# EAGLE design my_dac_amp_pwr_v0002 (EAGLE 6.4)
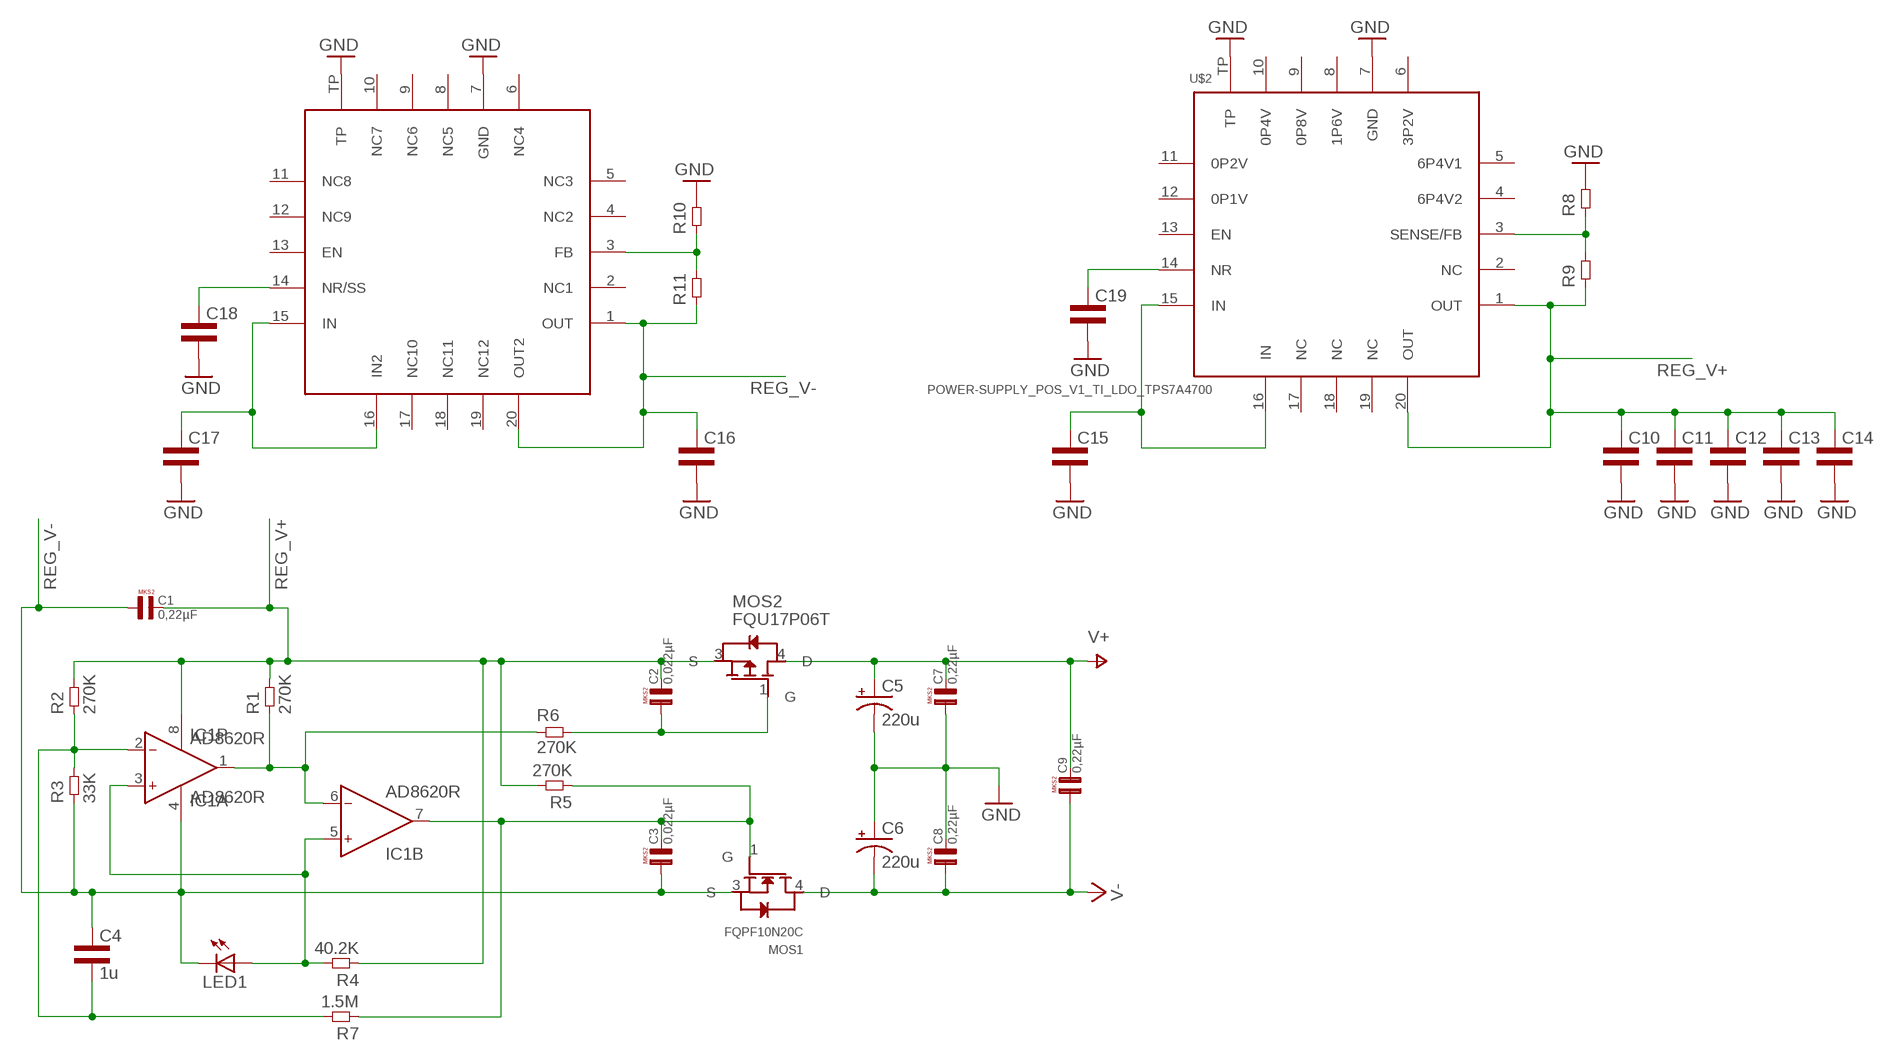
[diagram p0: schematic, sheet 1]

## Parts
C1  0,22µF  [R5B3]
C2  0,022µF  [R5B2K5]
C3  0,022µF  [R5B2K5]
C4  1u  CAP0805L3  [0805L3]
C5  220u  CPOL-USE5-10.5  [E5-10,5]
C6  220u  CPOL-USE5-10.5  [E5-10,5]
C7  0,22µF  [R5B3]
C8  0,22µF  [R5B3]
C9  0,22µF  [R5B3]
C10  CAP0805L3  [0805L3]
C11  CAP0805L3  [0805L3]
C12  CAP0805L3  [0805L3]
C13  CAP0805L3  [0805L3]
C14  CAP0805L3  [0805L3]
C15  CAP0805L3  [0805L3]
C16  CAP0805L3  [0805L3]
C17  CAP0805L3  [0805L3]
C18  CAP0603L3  [0603L3]
C19  CAP0603L3  [0603L3]
IC1  AD8620R  [SO8]
LED1  LED3MM  [LED3MM]
MOS1  FQPF10N20C  MOSFET-N  [DPAK-3]
MOS2  FQU17P06T  MOSFET-P  [DPAK-3]
R1  270K  RES0805L3  [0805L3]
R2  270K  RES0805L3  [0805L3]
R3  33K  RES0805L3  [0805L3]
R4  40.2K  RES0805L3  [0805L3]
R5  270K  RES0805L3  [0805L3]
R6  270K  RES0805L3  [0805L3]
R7  1.5M  RES0805L3  [0805L3]
R8  RES0603L3  [0603L3]
R9  RES0603L3  [0603L3]
R10  RES0603L3  [0603L3]
R11  RES0603L3  [0603L3]
U$1  POWER-SUPPLY_POS_V1_TI_LDO_TPS7A3301RGWT  [POWER-SUPPLY_POS_V1_TI_LDO_VQFN-20]
U$2  POWER-SUPPLY_POS_V1_TI_LDO_TPS7A4700  [POWER-SUPPLY_POS_V1_TI_LDO_VQFN-20]

## Nets
GND: C5.- C6.+ C7.1 C8.2 C10.2 C11.2 C12.2 C13.2 C14.2 C15.2 C16.2 C17.2 C18.P$2 C19.P$2 R8.P$2 R10.P$2 U$1.7(GND) U$1.TP U$2.7(GND) U$2.TP
N$1: IC1.3(A:IN+) IC1.5(B:IN+) LED1.A R4.2
N$2: C4.2 IC1.2(A:IN-) R2.1 R3.2 R7.2
N$4: IC1.1(A:OUT) IC1.6(B:IN-) R1.1 R6.1
N$5: C17.1 U$1.15(IN) U$1.16(IN2)
N$6: C2.1 MOS2.1(G) R6.2
N$7: C15.1 U$2.15(IN) U$2.16(IN)
N$10: C3.2 IC1.7(B:OUT) MOS1.1(G) R5.1 R7.1
N$11: R10.P$1 R11.P$2 U$1.3(FB)
N$12: R8.P$1 R9.P$2 U$2.3(SENSE/FB)
N$14: C18.P$1 U$1.14(NR/SS)
N$15: C19.P$1 U$2.14(NR)
REG_V+: C1.2 C2.2 C10.1 C11.1 C12.1 C13.1 C14.1 IC1.8(P:V+) MOS2.3(S) R1.2 R2.2 R4.1 R5.2 R9.P$1 U$2.1(OUT) U$2.20(OUT)
REG_V-: C1.1 C3.1 C4.1 C16.1 IC1.4(P:V-) LED1.K(C) MOS1.3(S) R3.1 R11.P$1 U$1.1(OUT) U$1.20(OUT2)
V+: C5.+ C7.2 C9.2 MOS2.4(D)
V-: C6.- C8.1 C9.1 MOS1.4(D)
Unconnected: U$1.2(NC1) U$1.4(NC2) U$1.5(NC3) U$1.6(NC4) U$1.8(NC5) U$1.9(NC6) U$1.10(NC7) U$1.11(NC8) U$1.12(NC9) U$1.13(EN) U$1.17(NC10) U$1.18(NC11) U$1.19(NC12) U$2.2(NC) U$2.4(6P4V2) U$2.5(6P4V1) U$2.6(3P2V) U$2.8(1P6V) U$2.9(0P8V) U$2.10(0P4V) U$2.11(0P2V) U$2.12(0P1V) U$2.13(EN) U$2.17(NC) U$2.18(NC) U$2.19(NC)

## Library data of the parts
C1 C7-C9 = Capacitor-Wima-MKS2-63v:0,22µF
C2 C3 = Capacitor-Wima-MKS2-63v:0,022µF
C4 C10-C19 = common:CAP
C5 C6 = rcl:CPOL-US: POLARIZED CAPACITOR, American symbol
IC1 = analog-devices:AD8620: Precision, Very Low Noise, Low Input Bias Current, Wide Bandwidth JFET Operational Amplifiers Source: http://www.analog.com/static/imported-files/data_sheets/AD8610_8620.pdf; MF: ALTERA CORPORATION; MPN: AD8620ARZ; OC_FARNELL: 9994386; OC_NEWARK: 59K6972
LED1 = SparkFun-LED:LED: LEDs Standard schematic elements and footprints for 5mm, 3mm, 1206, and 0603 sized LEDs. 5mm - Spark Fun Electronics SKU : COM-00529 (and others)
MOS1 = common:MOSFET-N
MOS2 = common:MOSFET-P
R1-R11 = common:RES
U$1 = my_dac_amp:POWER-SUPPLY_POS_V1_TI_LDO_TPS7A3301RGWT: Ultra-Low Noise NEGATIVE Voltage Reglator
U$2 = my_dac_amp:POWER-SUPPLY_POS_V1_TI_LDO_TPS7A4700

## Board
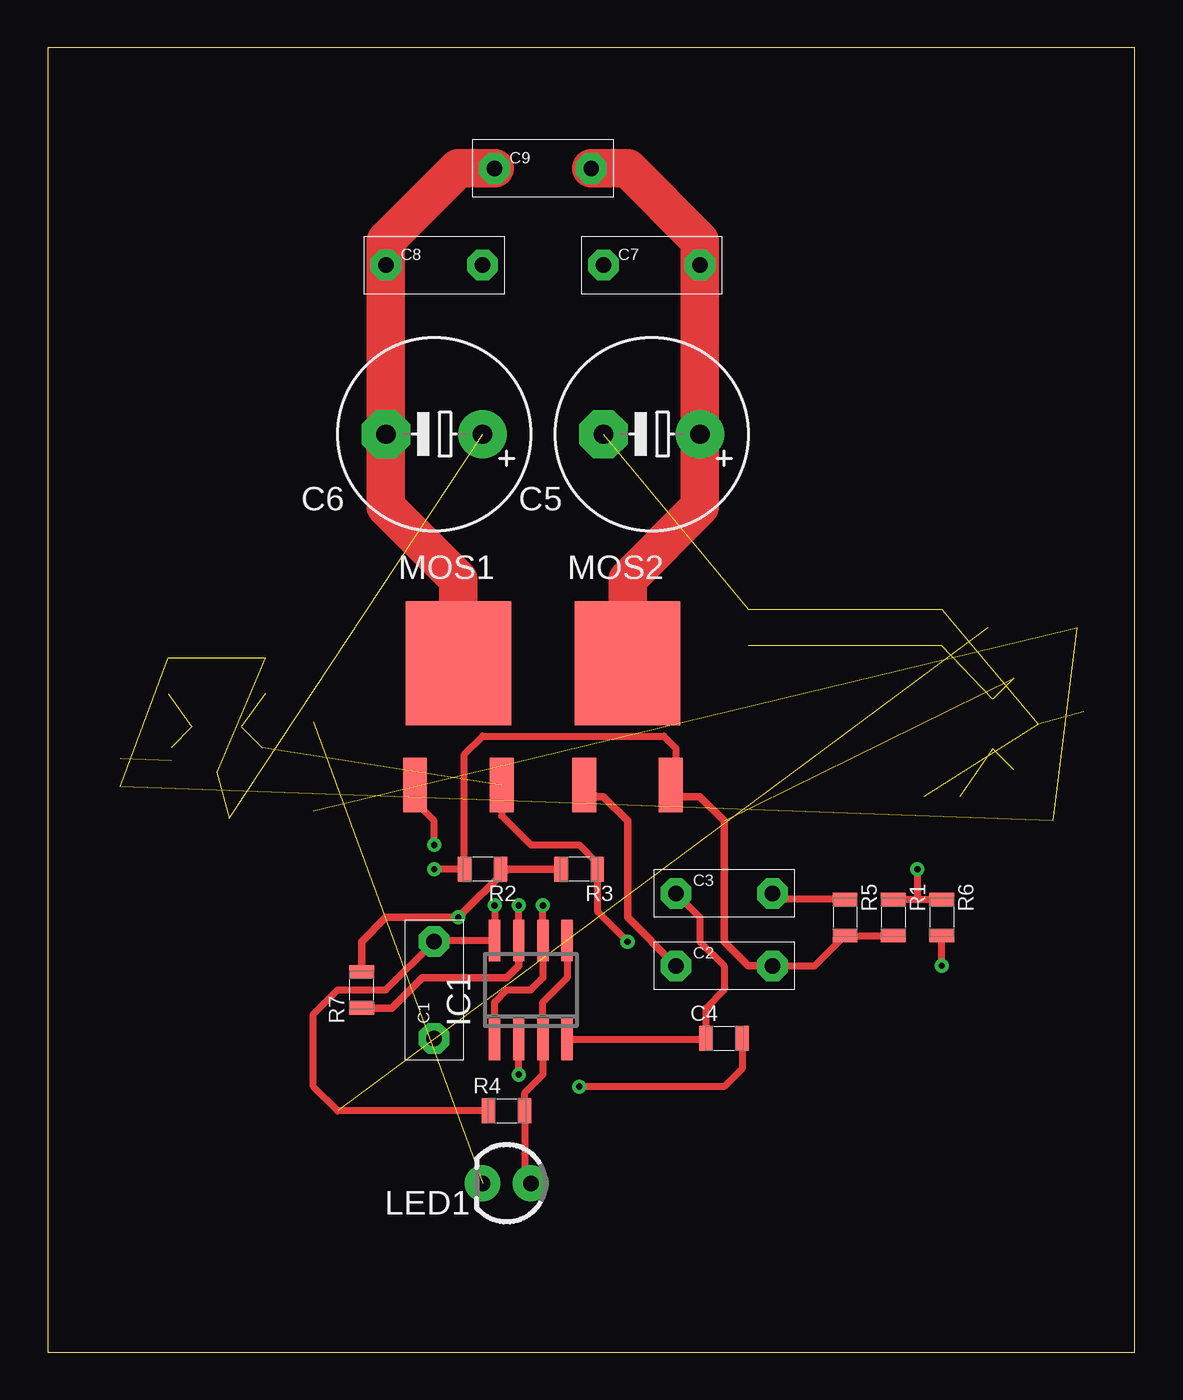
[diagram p1: board, top side]
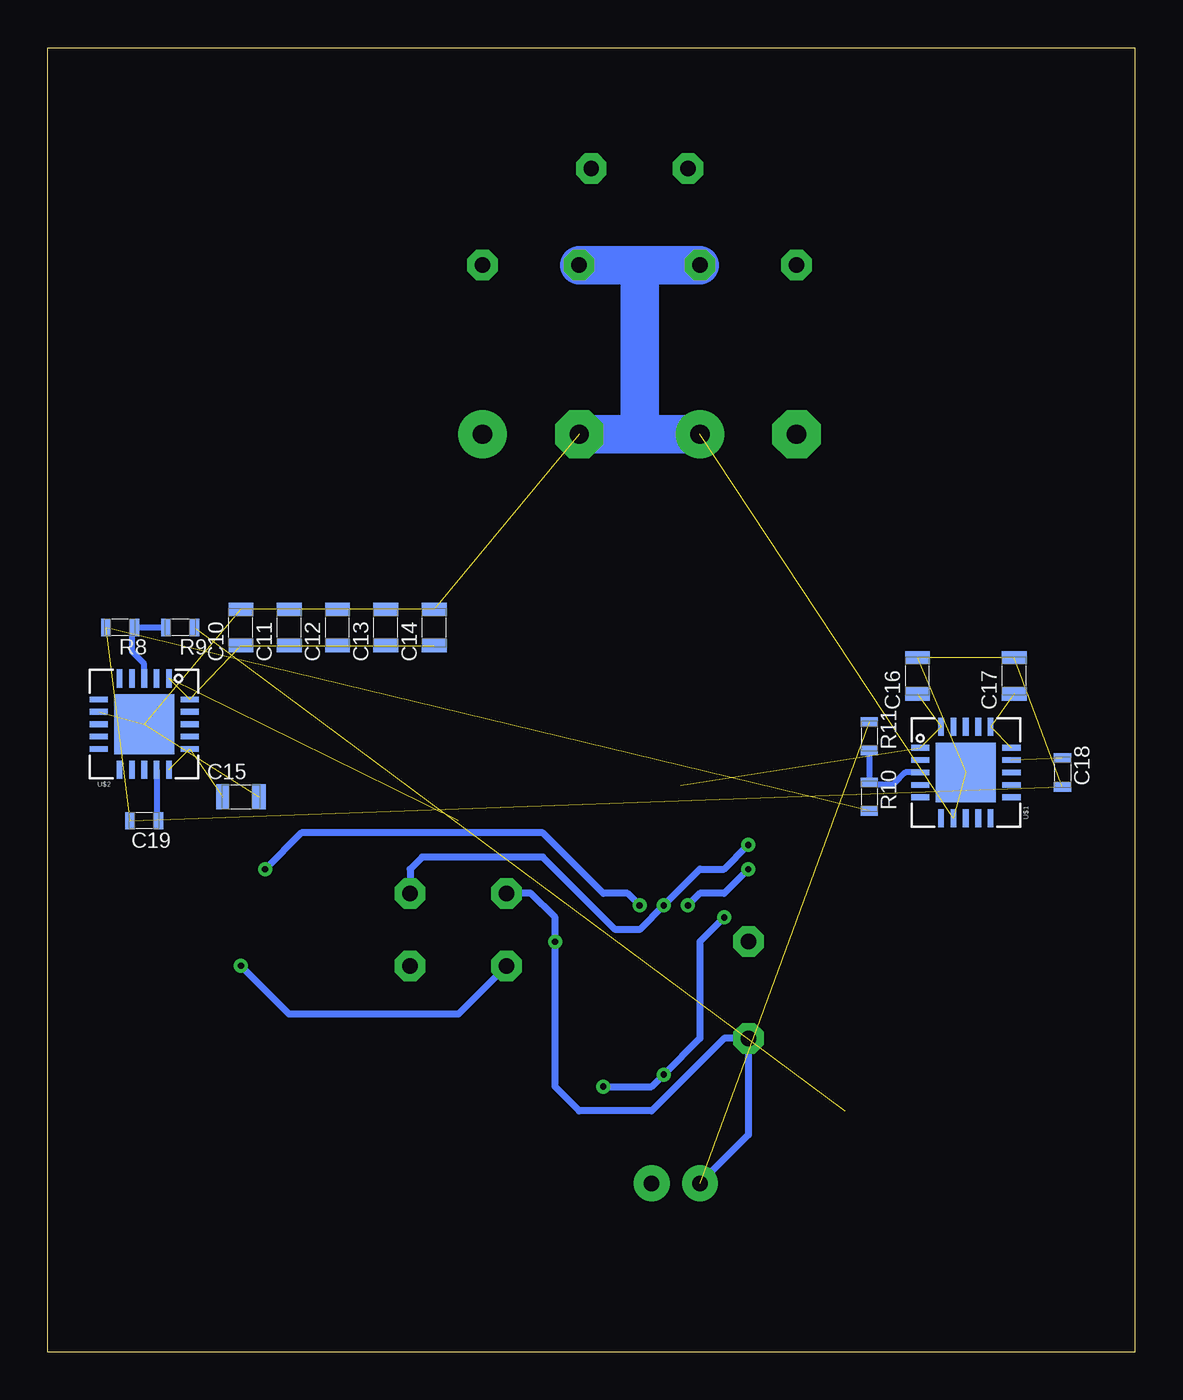
[diagram p2: board, bottom side, seen from below]

Size 57.15 x 68.58 mm. Coordinates in mm from the lower left corner, seen from the top.
Outline: 0,0 57.13,0 57.15,68.58 0,68.58 0,0
Copper layers (1*16): Top 0.035mm / dielectric 1.5mm / Bottom 0.035mm
Design rules "default": minimum track width 10mil, minimum drill 24mil, track to track 8mil, track to pad 8mil, pad to pad 8mil, via to via 8mil, smd to smd 8mil, copper to edge 40mil, drill to drill 8mil, minimum pad ring 10mil, minimum via ring 8mil, stop-mask expansion 4mil, vias tented up to drill 0mil, thermal gap 10mil

### Footprints (pad centres in the part's own frame; a part is rotated, then mirrored left to right if it is on the bottom)
R5B3 = drill 0.813 pad 1.6 octagon: 1 -2.54,0; 2 2.54,0
R5B2K5 = drill 0.813 pad 1.6 octagon: 1 -2.54,0; 2 2.54,0
0805L3 = smd 0.7 x 1.3: 1 -0.95,0; 2 0.95,0
E5-10,5 = drill 1.016 pad 2.54: + -2.54,0 | drill 1.016 pad 2.54 octagon: - 2.54,0
0603L3 = smd 0.5 x 0.9: P$1 -0.75,0; P$2 0.75,0
SO8 = smd 0.6 x 2.2: 1 -1.905,-2.6; 2 -0.635,-2.6; 3 0.635,-2.6; 4 1.905,-2.6; 5 1.905,2.6; 6 0.635,2.6; 7 -0.635,2.6; 8 -1.905,2.6
LED3MM = drill 0.813 pad 1.88: A -1.27,0; K 1.27,0
DPAK-3 = smd 1.25 x 2.85: 1 -2.28,-3.2; 3 2.28,-3.2 | smd 5.55 x 6.5: 4 0,3.2
POWER-SUPPLY_POS_V1_TI_LDO_VQFN-20 = smd 0.3 x 0.95: 1 -1.3,-2.4; 2 -0.65,-2.4; 3 0,-2.4; 4 0.65,-2.4; 5 1.3,-2.4; 11 1.3,2.4; 12 0.65,2.4; 13 0,2.4; 14 -0.65,2.4; 15 -1.3,2.4 | smd 0.95 x 0.3: 6 2.4,-1.3; 7 2.4,-0.65; 8 2.4,0; 9 2.4,0.65; 10 2.4,1.3; 16 -2.4,1.3; 17 -2.4,0.65; 18 -2.4,0; 19 -2.4,-0.65; 20 -2.4,-1.3 | smd 3.15 x 3.15: TP 0,0

### Placement (x,y rotation side)
C1  20.32,19.05 90 top
C2  35.56,20.32 0 top
C3  35.56,24.13 0 top
C4  35.56,16.51 0 top
C5  31.75,48.26 180 top
C6  20.32,48.26 180 top
C7  31.75,57.15 0 top
C8  20.32,57.15 0 top
C9  26.04,62.23 0 top
C10  46.99,38.1 90 bottom
C11  44.45,38.1 90 bottom
C12  41.91,38.1 90 bottom
C13  39.37,38.1 90 bottom
C14  36.83,38.1 90 bottom
C15  46.99,29.21 0 bottom
C16  11.43,35.56 90 bottom
C17  6.35,35.56 90 bottom
C18  3.81,30.48 270 bottom
C19  52.07,27.94 180 bottom
IC1  25.4,19.05 0 top
LED1  24.13,8.89 180 top
MOS1  21.59,33.02 0 top
MOS2  30.48,33.02 0 top
R1  44.45,22.86 270 top
R2  22.86,25.4 180 top
R3  27.94,25.4 180 top
R4  24.13,12.7 0 top
R5  41.91,22.86 270 top
R6  46.99,22.86 270 top
R7  16.51,19.05 90 top
R8  53.34,38.1 180 bottom
R9  50.16,38.1 180 bottom
R10  13.97,29.21 270 bottom
R11  13.97,32.39 270 bottom
U$1  8.89,30.48 270 bottom
U$2  52.07,33.02 180 bottom

### Tracks (layer width: path | path; a pad name or v marks a point on that pad's centre or on a via)
GND  (16 unrouted)
  Bottom 2.032: C6.+ 26.04,48.26 | 26.04,48.26 C5.- | 26.04,57.15 C8.2 | C7.1 26.04,57.15 | 26.04,57.15 26.04,48.26
N$1
  Top 0.356: IC1.5 27.3,19.69 26.04,18.41 IC1.3 26.04,14.6 25.08,13.65 R4.2 25.08,9.21 LED1.A
N$2  (via drill 0.33)
  Top 0.356: C4.2 36.51,14.92 35.56,13.97 v27.94,13.97 | v24.76,14.6 IC1.2
  Top 0.406: R3.2 24.13,25.4 | 24.13,25.4 R2.1 | R7.2 16.51,21.59 17.78,22.86 v21.59,22.86 24.13,25.4
  Bottom 0.356: v27.94,13.97 25.4,13.97 v24.76,14.6 22.86,16.51 22.86,21.59 v21.59,22.86
N$4  (via drill 0.33)
  Top 0.356: R1.1 45.72,23.81 | 45.72,23.81 R6.1 | IC1.1 23.49,18.41 24.13,19.05 25.4,19.05 26.04,19.69 IC1.6 v26.04,23.49 | v45.72,25.4 45.72,23.81
  Bottom 0.356: v26.04,23.49 26.67,24.13 27.94,24.13 31.12,27.3 43.82,27.3 v45.72,25.4
N$5  (2 unrouted)
N$6  (via drill 0.33)
  Top 0.356: v46.99,20.32 R6.2
  Top 0.406: C2.1 30.48,22.86 30.48,27.94 29.21,29.21 28.81,29.21 MOS2.1
  Bottom 0.356: C2.1 35.56,17.78 44.45,17.78 v46.99,20.32
N$7  (2 unrouted)
N$10  (via drill 0.33)
  Top 0.356: IC1.7 v24.76,23.49 | v20.32,26.67 20.32,27.94 19.05,29.21 19.05,29.56 MOS1.1 | R5.1 38.42,23.81 C3.2
  Top 0.406: R7.1 18.1,18.1 19.68,19.69 24.13,19.69 24.76,20.32 IC1.7
  Bottom 0.356: v20.32,26.67 21.59,25.4 22.86,25.4 v24.76,23.49 26.04,22.23 27.3,22.23 31.12,26.03 37.46,26.03 38.1,25.4 C3.2
N$11
  Bottom 0.305: U$1.3 12.07,30.48 12.7,29.84 13.85,29.84 R10.P$1 R11.P$2
N$12
  Bottom 0.305: U$2.3 52.07,36.19 52.71,36.83 52.71,38.1 R8.P$1 R9.P$2
N$14  (1 unrouted)
N$15
  Bottom 0.305: U$2.14 51.42,28.04 C19.P$1
REG_V+  (via drill 0.33)  (8 unrouted)
  Top 0.356: R4.1 15.24,12.7 13.97,13.97 13.97,17.78 15.24,19.05 17.78,19.05 C1.2 20.38,21.65 IC1.8 v23.49,23.49 | v20.32,25.4 R2.2 21.91,31.44 22.86,32.39 32.38,32.39 33.02,31.75 33.02,30.48 32.38,29.84 32.74,29.84 MOS2.3 | C2.2 40.32,20.32 R5.2 R1.2
  Top 0.406: C2.2 36.83,20.32 35.56,21.59 35.56,27.94 34.29,29.21 33.37,29.21 MOS2.3
  Bottom 0.356: v20.32,25.4 21.59,24.13 22.86,24.13 v23.49,23.49
REG_V-  (via drill 0.33)  (4 unrouted)
  Top 0.356: MOS1.3 23.87,28.2 25.4,26.67 27.94,26.67 28.89,25.72 R3.1 28.89,23.18 v30.48,21.59 | IC1.4 34.55,16.45 C4.1 34.61,18.1 35.56,19.05 35.56,20.32 34.29,21.59 34.29,22.86 C3.1
  Bottom 0.356: LED1.K 20.32,11.43 C1.1 21.59,16.51 25.4,12.7 29.21,12.7 30.48,13.97 v30.48,21.59 30.48,22.86 31.75,24.13 C3.1
V+
  Top 2.032: MOS2.4 30.48,40.64 34.29,44.45 C5.+ C7.2 34.29,58.42 30.48,62.23 C9.2
V-
  Top 2.032: MOS1.4 21.59,40.64 17.78,44.45 C6.- C8.1 17.78,58.42 21.59,62.23 C9.1